# EAGLE schematic TeensyPrototypeBoard (EAGLE 6.5.0)

## Sheet 1 of 2
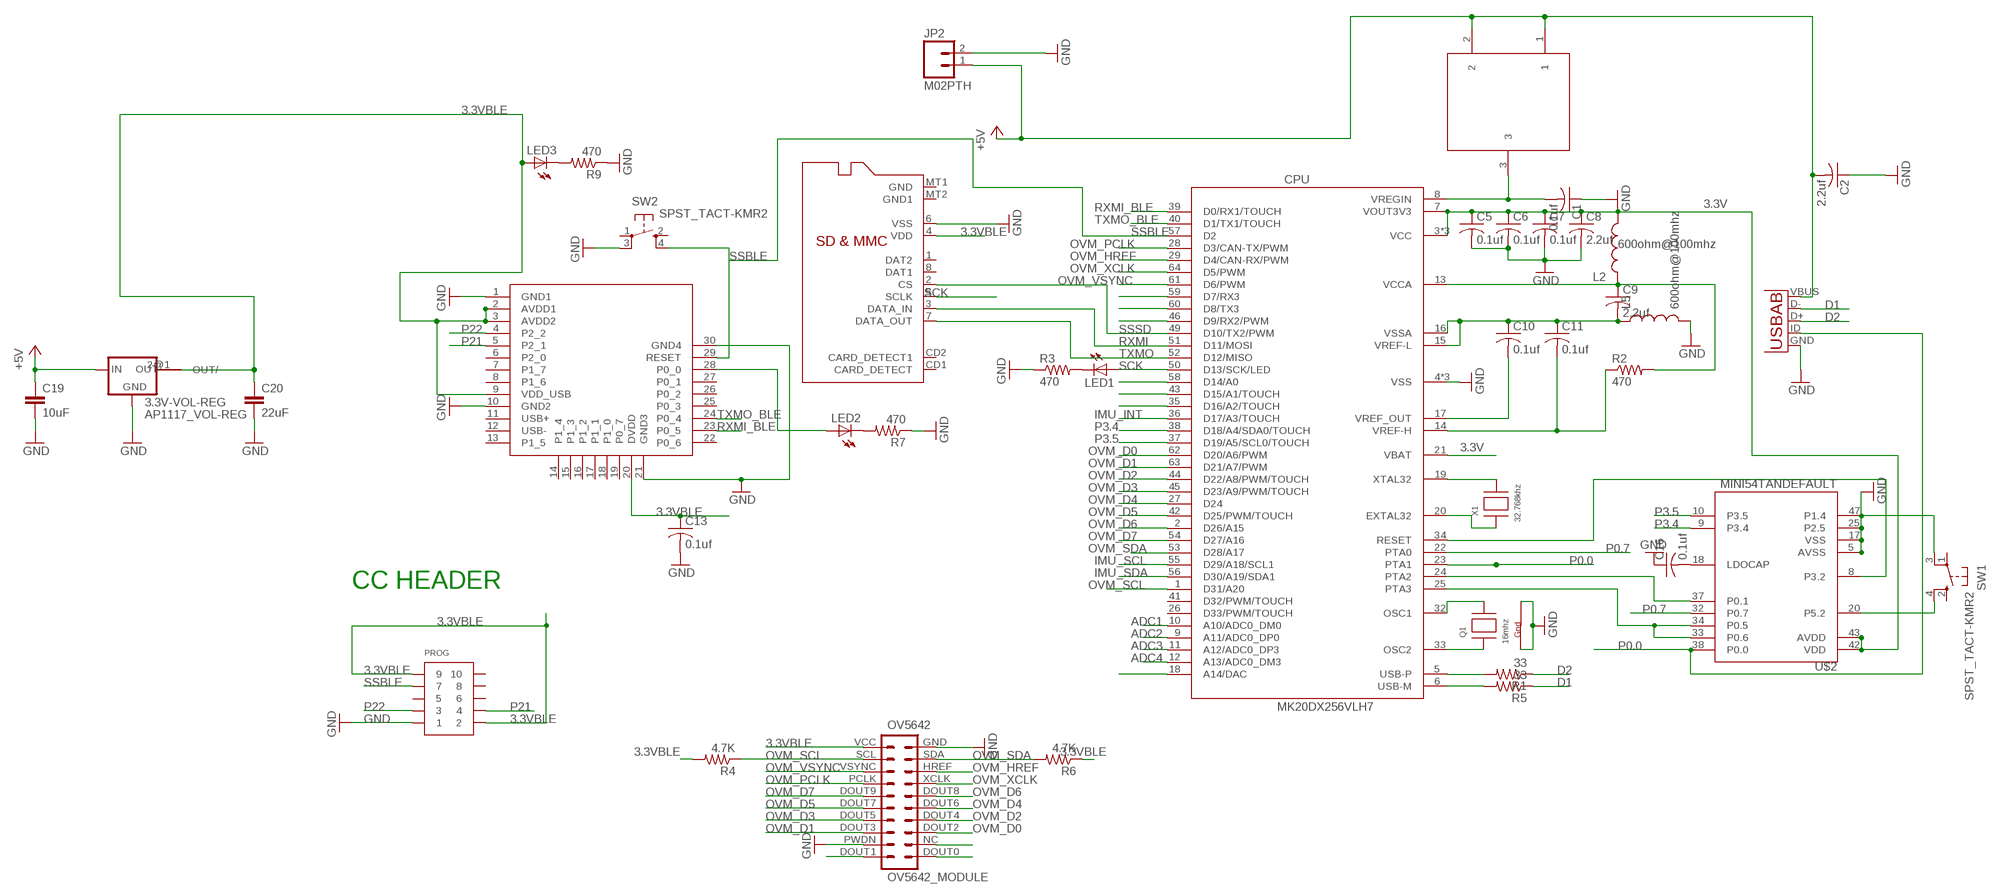
[diagram p0: schematic, sheet 1]

### Parts
3.3V-VOL-REG  AP1117_VOL-REG  [SOT-89]
C1  0.1uf  C-USC0603  [C0603]
C2  2.2uf  C-USC0603  [C0603]
C5  0.1uf  C-USC0603  [C0603]
C6  0.1uf  C-USC0603  [C0603]
C7  0.1uf  C-USC0603  [C0603]
C8  2.2uf  C-USC0603  [C0603]
C9  2.2uf  C-USC0603  [C0603]
C10  0.1uf  C-USC0603  [C0603]
C11  0.1uf  C-USC0603  [C0603]
C13  0.1uf  C-USC0603  [C0603]
C16  0.1uf  C-USC0603  [C0603]
C19  10uF  CAP0603-CAP  [0603-CAP]
C20  22uF  CAP0603-CAP  [0603-CAP]
CPU  MK20DX256VLH7  [QFP50P1200X1200X160-64N]
JP2  M02PTH  [1X02]
L2  600ohm@100mhz  INDUCTOR0603  [0603]
L5  600ohm@100mhz  INDUCTOR0603  [0603]
LED1  LEDCHIP-LED0603  [CHIP-LED0603]
LED2  LEDCHIP-LED0603  [CHIP-LED0603]
LED3  LEDCHIP-LED0603  [CHIP-LED0603]
OV5642  OV5642_MODULE  [OV5642_MODULE]
PROG  CONN_5-2-FTSH-V  [FTSH-105-DV]
Q1  16mhz  XTAL-4-3225  [NX3225]
R1  33  R-US_R0603  [R0603]
R2  470  R-US_R0603  [R0603]
R3  470  R-US_R0603  [R0603]
R4  4.7K  R-US_R0603  [R0603]
R5  33  R-US_R0603  [R0603]
R6  4.7K  R-US_R0603  [R0603]
R7  470  R-US_R0603  [R0603]
R9  470  R-US_R0603  [R0603]
SW1  SPST_TACT-KMR2  [KMR2]
SW2  SPST_TACT-KMR2  [KMR2]
U1  USB-AB  [USB-AB-MICRO-SMD]
U3  BLE112-A  [BLE112-A]
U$2  MINI54TANDEFAULT  [QFP50P900X900X160-48N]
U$3  MICROSD  [MICROSD]
U$4  PMEG4010CPA  [PMEG4010CPA]
X1  32.768khz  XTAL-3.2X1.5  [XTAL3215]

### Nets
3.3V: C5.1 C6.1 C7.1 C8.1 CPU.3(VCC) CPU.7(VOUT3V3) CPU.21(VBAT) CPU.30(VCC) CPU.48(VCC) L2.2 U$2.42(VDD) U$2.43(AVDD)
3.3VBLE: 3.3V-VOL-REG.2(OUT) C13.1 C20.1 LED3.A OV5642.VCC PROG.2 PROG.9 R4.2 R6.1 U3.2(AVDD1) U3.3(AVDD2) U3.9(VDD_USB) U3.20(DVDD) U$3.4(VDD) ; also sheet 2
+5V: 3.3V-VOL-REG.3(IN) C2.2 C19.1 JP2.1 U1.VBUS U$4.1 U$4.2
ADC1: CPU.10(A10/ADC0_DM0)
ADC2: CPU.9(A11/ADC0_DP0)
ADC3: CPU.11(A12/ADC0_DP3)
ADC4: CPU.12(A13/ADC0_DM3)
D1: R5.1 U1.D-
D2: R1.1 U1.D+
GND: 3.3V-VOL-REG.1(GND) C1.1 C2.1 C5.2 C6.2 C7.2 C8.2 C13.2 C16.1 C19.2 C20.2 CPU.4(VSS) CPU.31(VSS) CPU.47(VSS) JP2.2 L5.2 OV5642.GND OV5642.PWDN PROG.1 Q1.2(G2) Q1.4(G1) R3.1 R7.1 R9.1 SW1.3(P1) SW2.3(P1) U1.GND U3.1(GND1) U3.10(GND2) U3.21(GND3) U3.30(GND4) U$2.5(AVSS) U$2.17(VSS) U$2.25(P2.5) U$2.47(P1.4) U$3.6(VSS) ; also sheet 2
IMU_INT: CPU.36(D17/A3/TOUCH) ; also sheet 2
IMU_SCL: CPU.55(D29/A18/SCL1) ; also sheet 2
IMU_SDA: CPU.56(D30/A19/SDA1) ; also sheet 2
N$1: CPU.19(XTAL32) X1.P$2
N$2: C1.2 CPU.8(VREGIN) U$4.3
N$4: C9.2 C10.1 C11.1 CPU.15(VREF-L) CPU.16(VSSA) L5.1
N$5: C10.2 CPU.17(VREF_OUT)
N$6: C9.1 CPU.13(VCCA) L2.1 R2.2
N$7: C11.2 CPU.14(VREF-H) R2.1
N$8: CPU.20(EXTAL32) X1.P$1
N$9: CPU.32(OSC1) Q1.3(X2)
N$10: CPU.33(OSC2) Q1.1(X1)
N$11: CPU.5(USB-P) R1.2
N$12: CPU.6(USB-M) R5.2
N$13: LED1.C R3.2
N$14: CPU.34(RESET) U$2.8(P3.2)
N$15: CPU.58(D14/A0)
N$16: CPU.43(D15/A1/TOUCH)
N$17: SW1.4(S1) U$2.20(P5.2)
N$18: LED3.C R9.2
N$19: CPU.24(PTA2) U$2.37(P0.1)
N$20: CPU.35(D16/A2/TOUCH)
N$22: CPU.25(PTA3) U$2.33(P0.6) U$2.34(P0.5)
N$26: CPU.18(A14/DAC)
N$28: LED2.C R7.2
N$29: LED2.A U3.28(P0_0)
N$31: CPU.59(D7/RX3)
N$32: CPU.60(D8/TX3)
N$33: CPU.46(D9/RX2/PWM)
N$36: C16.2 U$2.18(LDOCAP)
N$41: OV5642.DOUT1
N$48: OV5642.NC
N$49: OV5642.DOUT0
OVM_D0: CPU.62(D20/A6/PWM) OV5642.DOUT2
OVM_D1: CPU.63(D21/A7/PWM) OV5642.DOUT3
OVM_D2: CPU.44(D22/A8/PWM/TOUCH) OV5642.DOUT4
OVM_D3: CPU.45(D23/A9/PWM/TOUCH) OV5642.DOUT5
OVM_D4: CPU.27(D24) OV5642.DOUT6
OVM_D5: CPU.42(D25/PWM/TOUCH) OV5642.DOUT7
OVM_D6: CPU.2(D26/A15) OV5642.DOUT8
OVM_D7: CPU.54(D27/A16) OV5642.DOUT9
OVM_HREF: CPU.29(D4/CAN-RX/PWM) OV5642.HREF
OVM_PCLK: CPU.28(D3/CAN-TX/PWM) OV5642.PCLK
OVM_SCL: CPU.1(D31/A20) OV5642.SCL R4.1
OVM_SDA: CPU.53(D28/A17) OV5642.SDA R6.2
OVM_VSYNC: CPU.61(D6/PWM) OV5642.VSYNC
OVM_XCLK: CPU.64(D5/PWM) OV5642.XCLK
P0.0: CPU.23(PTA1) U1.ID(USBID) U$2.38(P0.0)
P0.7: CPU.22(PTA0) U$2.32(P0.7)
P3.4: CPU.38(D18/A4/SDA0/TOUCH) U$2.9(P3.4)
P3.5: CPU.37(D19/A5/SCL0/TOUCH) U$2.10(P3.5)
P21: PROG.4 U3.5(P2_1)
P22: PROG.3 U3.4(P2_2)
RXMI: CPU.51(D11/MOSI) U$3.3(DATA_IN)
RXMI_BLE: CPU.39(D0/RX1/TOUCH) U3.23(P0_5)
SCK: CPU.50(D13/SCK/LED) LED1.A U$3.5(SCLK)
SSBLE: CPU.57(D2) PROG.7 SW2.4(S1) U3.29(RESET)
SSSD: CPU.49(D10/TX2/PWM) U$3.2(CS)
TXMO: CPU.52(D12/MISO) U$3.7(DATA_OUT)
TXMO_BLE: CPU.40(D1/TX1/TOUCH) U3.24(P0_4)
Unconnected: 3.3V-VOL-REG.2@1(OUT/) CPU.26(D33/PWM/TOUCH) CPU.41(D32/PWM/TOUCH) PROG.5 PROG.6 PROG.8 PROG.10 SW1.1(P) SW1.2(S) SW2.1(P) SW2.2(S) U3.6(P2_0) U3.7(P1_7) U3.8(P1_6) U3.11(USB+) U3.12(USB-) U3.13(P1_5) U3.14(P1_4) U3.15(P1_3) U3.16(P1_2) U3.17(P1_1) U3.18(P1_0) U3.19(P0_7) U3.22(P0_6) U3.25(P0_3) U3.26(P0_2) U3.27(P0_1) U$3.1(DAT2) U$3.8(DAT1) U$3.CD1(CARD_DETECT) U$3.CD2(CARD_DETECT1) U$3.MT1(GND) U$3.MT2(GND1)

### Notes on the sheet
- CC HEADER

## Sheet 2 of 2: IMU
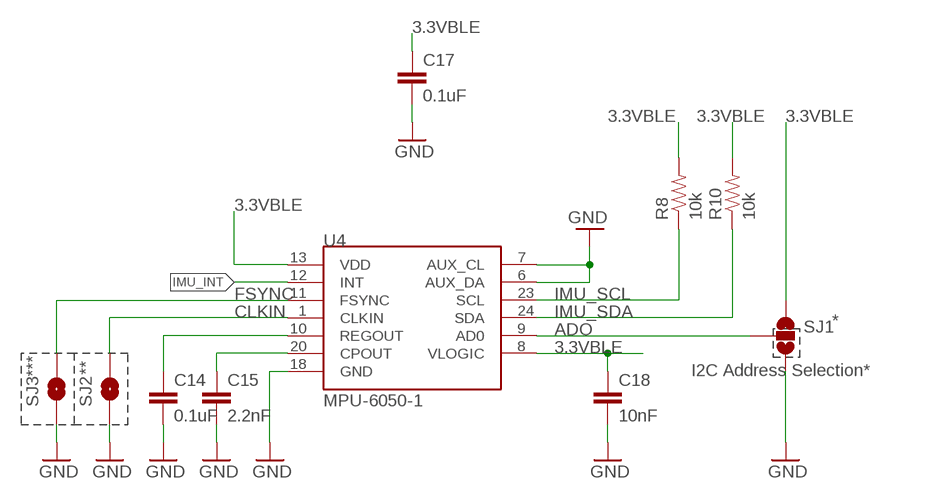
[diagram p1: schematic, sheet 2]

### Parts
C14  0.1uF  CAP0603-CAP  [0603-CAP]
C15  2.2nF  CAP0603-CAP  [0603-CAP]
C17  0.1uF  CAP0603-CAP  [0603-CAP]
C18  10nF  CAP0603-CAP  [0603-CAP]
R8  10k  RESISTOR0603-RES  [0603-RES]
R10  10k  RESISTOR0603-RES  [0603-RES]
SJ1  SOLDERJUMPER_2WAYPASTE2&3  [SJ_3_PASTE2&3]
SJ2  SOLDERJUMPERTRACE  [SJ_2S-TRACE]
SJ3  SOLDERJUMPERTRACE  [SJ_2S-TRACE]
U4  MPU-6050-1  [QFN-24-4MM2]

### Nets
3.3VBLE: C17.1 C18.1 R8.2 R10.2 SJ1.1 U4.8(VLOGIC) U4.13(VDD) ; also sheet 1
ADO: SJ1.2 U4.9(AD0)
CLKIN: SJ2.2 U4.1(CLKIN)
FSYNC: SJ3.2 U4.11(FSYNC)
GND: C14.2 C15.2 C17.2 C18.2 SJ1.3 SJ2.1 SJ3.1 U4.6(AUX_DA) U4.7(AUX_CL) U4.18(GND) ; also sheet 1
IMU_INT: U4.12(INT) ; also sheet 1
IMU_SCL: R8.1 U4.23(SCL) ; also sheet 1
IMU_SDA: R10.1 U4.24(SDA) ; also sheet 1
N$3: C15.1 U4.20(CPOUT)
N$23: C14.1 U4.10(REGOUT)

### Notes on the sheet
- *
- *** | ** | I2C Address Selection*

## Library data of the parts
3.3V-VOL-REG = Chao:AP1117_VOL-REG
C1 C2 C5-C11 C13 C16 = resistor:C-US: CAPACITOR, American symbol
C14 C15 C17-C20 = SparkFun:CAP: Capacitor Standard 0603 ceramic capacitor, and 0.1" leaded capacitor.
CPU = Teensy_3_Series_Chip_v1.0:MK20DX256VLH7: This is a footprint for the MK20dx256VHL7, the chip at the heart of the Teensy 3.1. Notable upgrades over the Teensy 3.0 include more Flash Memory, RAM, a DAC output, additional ADC pins, etc. Remember, if you want to use USB, VOut3v3 has to be attached to the 3.3V bus.
JP2 = SparkFun-Connectors:M02: Standard 2-pin 0.1" header. Use with - straight break away headers ( PRT-00116) - right angle break away headers (PRT-00553) - swiss pins (PRT-00743) - machine pins (PRT-00117) - female headers (PRT-00115) Molex polarized connector foot print use with: PRT-08233 with associated crimp pins and housings. 2.54_SCREWTERM for use with PRT-10571. 3.5mm Screw Terminal footprints for PRT-08084 5mm Screw Terminal footprints for use with PRT-08433
L2 L5 = SparkFun-Passives:INDUCTOR: Inductors Basic Inductor/Choke - 0603 and 1206. Footprints are not proven and vary greatly between part numbers. SRN6045- 33uH, 20% 1.4A
LED1-LED3 = adafruit:LED: LED OSRAM: - CHIPLED LG R971, LG N971, LY N971, LG Q971, LY Q971, LO R971, LY R971 LH N974, LH R974 LS Q976, LO Q976, LY Q976 LO Q996 - Hyper CHIPLED LW Q18S LB Q993, LB Q99A, LB R99A - SideLED LS A670, LO A670, LY A670, LG A670, LP A670 LB A673, LV A673, LT A673, LW A673 LH A674 LY A675 LS A676, LA A676, LO A676, LY A676, LW A676 LS A679, LY A679, LG A679 - Hyper Micro SIDELED® LS Y876, LA Y876, LO Y876, LY Y876 LT Y87S - SmartLED LW L88C, LW L88S LB L89C, LB L89S, LG L890 LS L89K, LO L89K, LY L89K LS L896, LA L896, LO L896, LY L896 - TOPLED LS T670, LO T670, LY T670, LG T670, LP T670 LSG T670, LSP T670, LSY T670, LOP T670, LYG T670 LG T671, LOG T671, LSG T671 LB T673, LV T673, LT T673, LW T673 LH T674 LS T676, LA T676, LO T676, LY T676, LB T676, LH T676, LSB T676, LW T676 LB T67C, LV T67C, LT T67C, LS T67K, LO T67K, LY T67K, LW E67C LS E67B, LA E67B, LO E67B, LY E67B, LB E67C, LV E67C, LT E67C LW T67C LS T679, LY T679, LG T679 LS T770, LO T770, LY T770, LG T770, LP T770 LB T773, LV T773, LT T773, LW T773 LH T774 LS E675, LA E675, LY E675, LS T675 LS T776, LA T776, LO T776, LY T776, LB T776 LHGB T686 LT T68C, LB T68C - Hyper Mini TOPLED® LB M676 - Mini TOPLED Santana® LG M470 LS M47K, LO M47K, LY M47K Source: http://www.osram.convergy.de/
OV5642 = Chao:OV5642_MODULE
PROG = pel_misc:CONN_5-2
Q1 = adafruit:XTAL-4: Classic 4-pin 3.2 x 2.5mm crystal
R1-R7 R9 = resistor:R-US_: RESISTOR, American symbol
R8 R10 = SparkFun:RESISTOR: Resistor Basic schematic elements and footprints for 0603, 1206, and PTH resistors.
SJ1 = SparkFun:SOLDERJUMPER_2WAY: Solder Jumper 2 way solder jumper
SJ2 SJ3 = SparkFun:SOLDERJUMPER: Solder Jumper Standard SMD solder jumper. Used to automate production. Two varients : Normally Open and Normally Closed are the same, but have different paste layers. NC will have a large amount of paste and should jumper during reflow.
SW1 SW2 = adafruit:SPST_TACT: SMT 6mm switch, EVQQ2 series http://www.ladyada.net/library/eagle
U1 = SparkFun-Connectors:USB-AB: This is a USB AB connector that is compatible with USB OTG. i.e. this connector can serve as a host or device
U3 = SparkFun-RF:BLE112-A: BlueGiga Bluetooth 4.0 module with integrated chip antenna and onboard 8051 processor and peripherals
U4 = Testing:MPU-6050
U$2 = Teensy_3_Series_Chip_v1.0:MINI54TAN: MINI54TAN Bootloader from PJRC.com, preprogrammed with Teensy 3.0 bootloader. https://www.pjrc.com/store/ic_mini54_tqfp.html
U$3 = adafruit:MICROSD: Micro-SD / Transflash card holder with SPI pinout For the 3M # 2908-05WB-MG and/or 4UCON #19656 push-push type
U$4 = zz_cbhar:PMEG4010CPA
X1 = adafruit:XTAL: Low cost SMT crystals, no capacitors included http://www.ladyada.net/library/eagle